# Altium schematic sheet THIEA3000 LIGHTING BOARD V2-1.SchDoc
size B; SheetNumber: 0; SheetTotal: 0
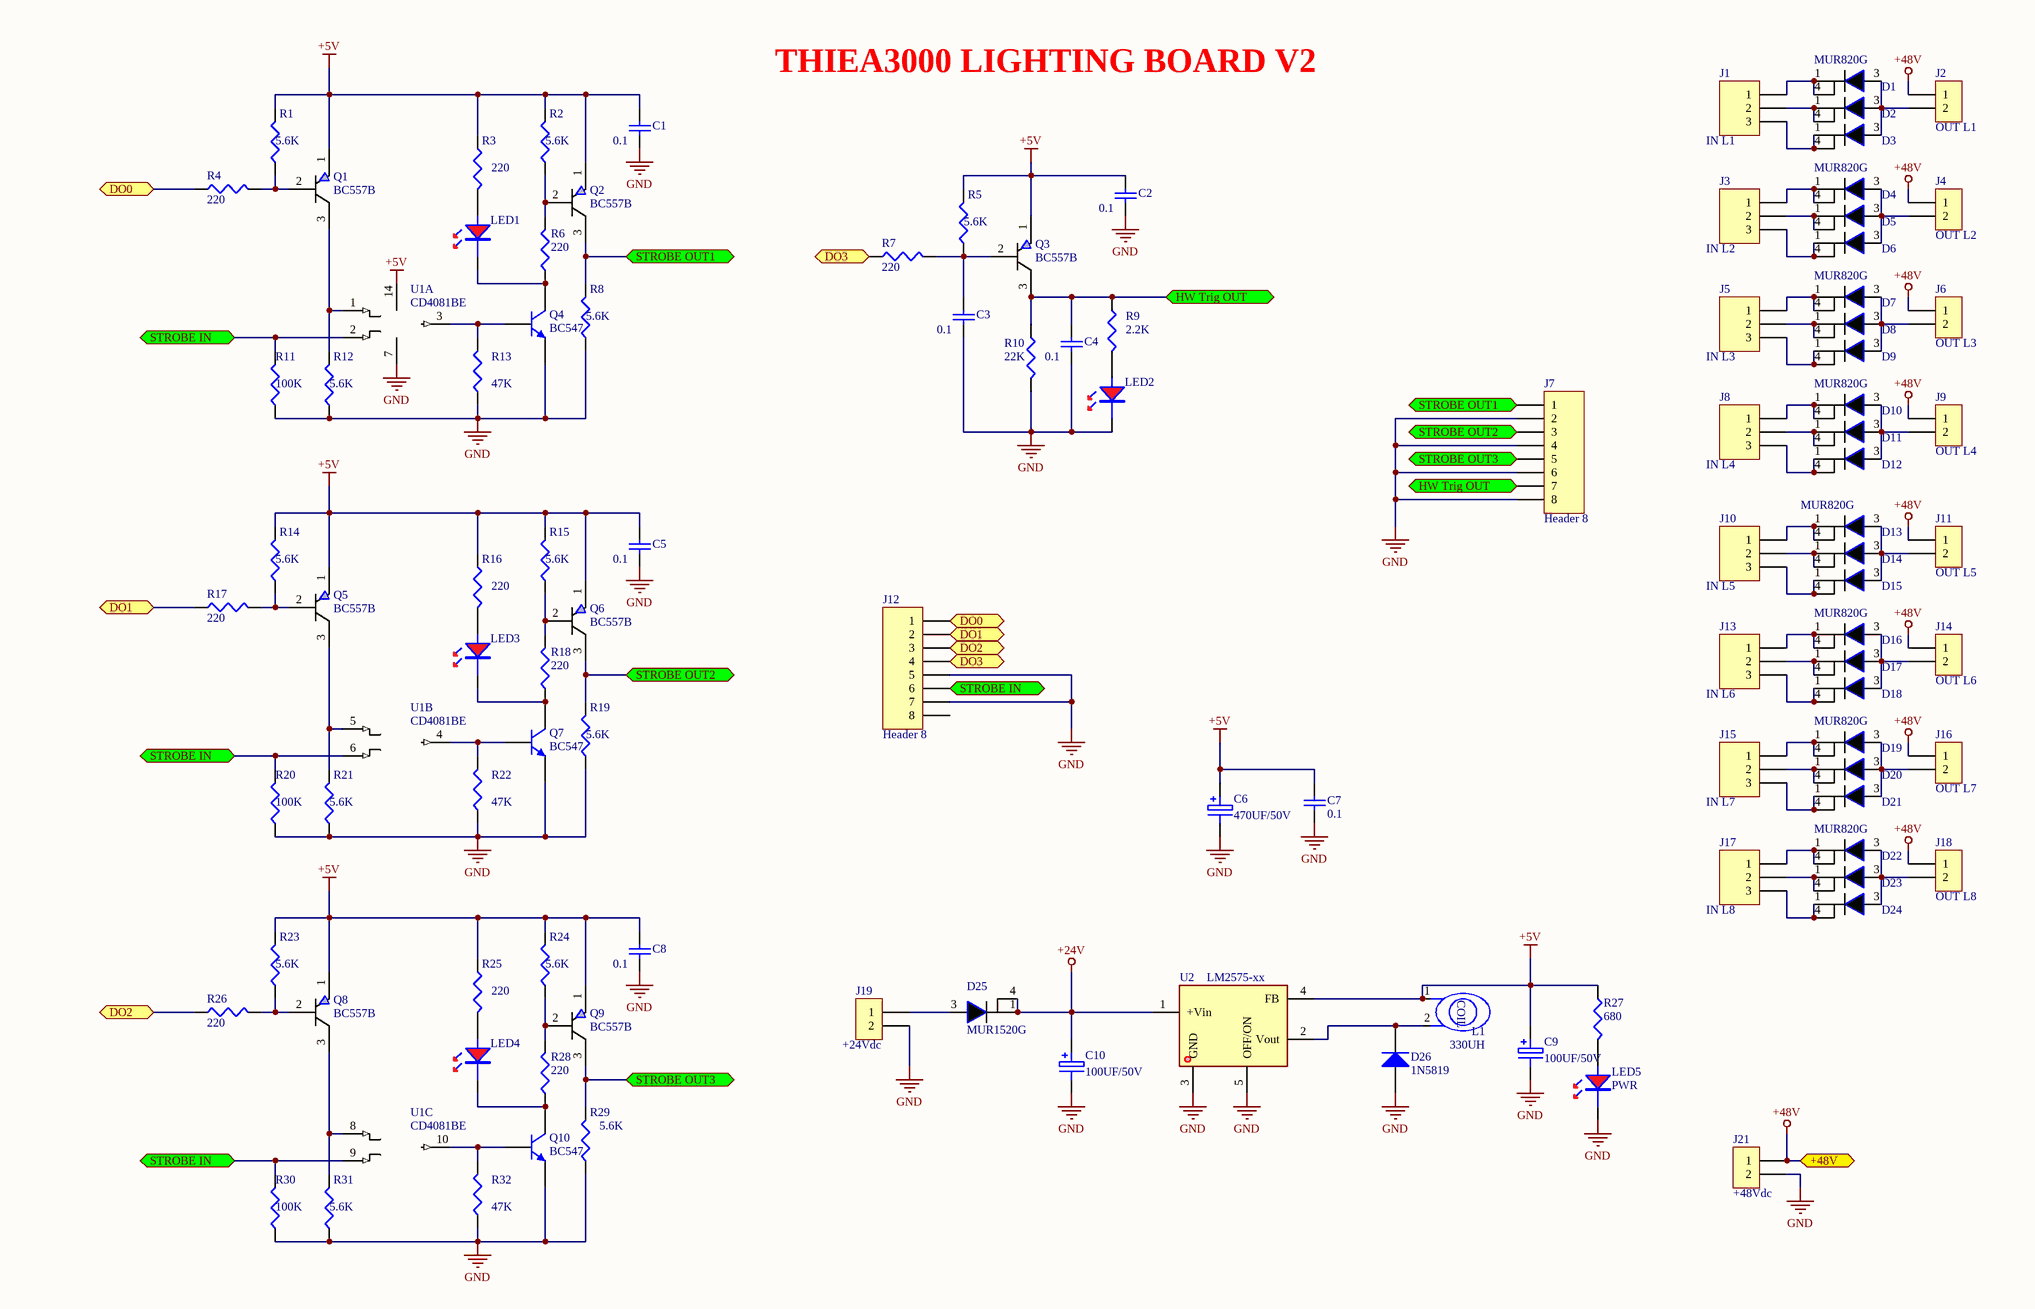
[diagram p0: THIEA3000 LIGHTING BOARD V2-1.SchDoc]

## Parts
C1  value 0.1  [CAP 5/8/Re]  (hidden comment: Cap)
C2  value 0.1  [CAP 5/8/Re]  (hidden comment: Cap)
C3  value 0.1  [CAP 5/8/Re]  (hidden comment: Cap)
C4  value 0.1  [CAP 5/8/Re]  (hidden comment: Cap)
C5  value 0.1  [CAP 5/8/Re]  (hidden comment: Cap)
C6  100UF/50V  [E-CAP 5.0/11]  (value not drawn)
C7  0.1  [CAP 5/8/Re]
C8  value 0.1  [CAP 5/8/Re]  (hidden comment: Cap)
C9  100UF/50V  [E-CAP 3.5/11]
C10  100UF/50V  [E-CAP 3.5/11]
D1  MUR820G  [TO-220(2)]
D2  MUR820G  [TO-220(2)]  (value not drawn)
D3  MUR820G  [TO-220(2)]  (value not drawn)
D4  MUR820G  [TO-220(2)]  (value not drawn)
D5  MUR820G  [TO-220(2)]
D6  MUR820G  [TO-220(2)]  (value not drawn)
D7  MUR820G  [TO-220(2)]
D8  MUR820G  [TO-220(2)]  (value not drawn)
D9  MUR820G  [TO-220(2)]  (value not drawn)
D10  MUR820G  [TO-220(2)]  (value not drawn)
D11  MUR820G  [TO-220(2)]
D12  MUR820G  [TO-220(2)]  (value not drawn)
D13  MUR820G  [TO-220(2)]  (value not drawn)
D14  MUR820G  [TO-220(2)]
D15  MUR820G  [TO-220(2)]  (value not drawn)
D16  MUR820G  [TO-220(2)]
D17  MUR820G  [TO-220(2)]  (value not drawn)
D18  MUR820G  [TO-220(2)]  (value not drawn)
D19  MUR820G  [TO-220(2)]  (value not drawn)
D20  MUR820G  [TO-220(2)]
D21  MUR820G  [TO-220(2)]  (value not drawn)
D22  MUR820G  [TO-220(2)]  (value not drawn)
D23  MUR820G  [TO-220(2)]
D24  MUR820G  [TO-220(2)]  (value not drawn)
D25  MUR1520G  [TO-220-2]
D26  1N5819  [DIODE 10.0]
J1  IN L1  [Plug-in TERM 5.0/3P/R]
J2  OUT L1  [Plug-in TERM 5.0/2P/RH]
J3  IN L2  [Plug-in TERM 5.0/3P/R]
J4  OUT L2  [Plug-in TERM 5.0/2P/RH]
J5  IN L3  [Plug-in TERM 5.0/3P/R]
J6  OUT L3  [Plug-in TERM 5.0/2P/RH]
J7  Header 8  [Plug-in terminal block 8P/3.5/RA]
J8  IN L4  [Plug-in TERM 5.0/3P/R]
J9  OUT L4  [Plug-in TERM 5.0/2P/RH]
J10  IN L5  [Plug-in TERM 5.0/3P/R]
J11  OUT L5  [Plug-in TERM 5.0/2P/RH]
J12  Header 8  [Plug-in terminal block 8P/3.5/RA]
J13  IN L6  [Plug-in TERM 5.0/3P/R]
J14  OUT L6  [Plug-in TERM 5.0/2P/RH]
J15  IN L7  [Plug-in TERM 5.0/3P/R]
J16  OUT L7  [Plug-in TERM 5.0/2P/RH]
J17  IN L8  [Plug-in TERM 5.0/3P/R]
J18  OUT L8  [Plug-in TERM 5.0/2P/RH]
J19  +24Vdc  [Plug-in TERM 5.0/2P/RH]
J21  +48Vdc  [Plug-in TERM 5.0/2P/RH]
L1  L1  [POWER L 4.5mm]  (value not drawn)
LED1  (no value)  [LED 3/2.54/R]
LED2  (no value)  [LED 3/2.54/R]
LED3  (no value)  [LED 3/2.54/R]
LED4  (no value)  [LED 3/2.54/R]
LED5  PWR  [LED 5/2.54/R]
Q1  PNP  [TO-92]  (value not drawn)
Q2  PNP  [TO-92]  (value not drawn)
Q3  PNP  [TO-92]  (value not drawn)
Q4  BC547  [TO-92]
Q5  PNP  [TO-92]  (value not drawn)
Q6  PNP  [TO-92]  (value not drawn)
Q7  BC547  [TO-92]
Q8  PNP  [TO-92]  (value not drawn)
Q9  PNP  [TO-92]  (value not drawn)
Q10  BC547  [TO-92]
R1  22K  [RES 1/4]  (value not drawn)
R2  22K  [RES 1/4]  (value not drawn)
R3  220  [RES 1/4]
R4  220  [RES 1/4]
R5  22K  [RES 1/4]  (value not drawn)
R6  22K  [RES 1/4]  (value not drawn)
R7  22K  [RES 1/4]  (value not drawn)
R8  22K  [RES 1/4]  (value not drawn)
R9  2.2K  [RES 1/4]
R10  22K  [RES 1/4]
R11  22K  [RES 1/4]  (value not drawn)
R12  22K  [RES 1/4]  (value not drawn)
R13  22K  [RES 1/4]  (value not drawn)
R14  22K  [RES 1/4]  (value not drawn)
R15  22K  [RES 1/4]  (value not drawn)
R16  220  [RES 1/4]
R17  220  [RES 1/4]
R18  22K  [RES 1/4]  (value not drawn)
R19  22K  [RES 1/4]  (value not drawn)
R20  22K  [RES 1/4]  (value not drawn)
R21  22K  [RES 1/4]  (value not drawn)
R22  22K  [RES 1/4]  (value not drawn)
R23  22K  [RES 1/4]  (value not drawn)
R24  22K  [RES 1/4]  (value not drawn)
R25  220  [RES 1/4]
R26  220  [RES 1/4]
R27  22K  [RES 1/4]  (value not drawn)
R28  22K  [RES 1/4]  (value not drawn)
R29  22K  [RES 1/4]  (value not drawn)
R30  22K  [RES 1/4]  (value not drawn)
R31  22K  [RES 1/4]  (value not drawn)
R32  22K  [RES 1/4]  (value not drawn)
U1  CD4081BE  [DIP-14L]  (parts A,B,C of 4)
U2  LM2575-xx  [TO-263(U)]

## Ports
+48V, DO0, DO1, DO2, DO3, HW Trig OUT, STROBE IN, STROBE OUT1, STROBE OUT2, STROBE OUT3

## Nets
+5V: C1.2 C2.2 C5.1 C6.1 C7.2 C8.2 C9.1 L1.1 Q1.1(E) Q2.1(E) Q3.1(E) Q5.1(E) Q6.1(E) Q8.1(E) Q9.1(E) R1.2 R2.2 R3.1 R5.2 R14.2 R15.2 R16.1 R23.2 R24.2 R25.1 R27.1 U1.14(+Vcc) U2.4(FB)
+24V: C10.1 D25.1(K2) D25.4(K1) U2.1(+Vin)
+48V: J2.1 J4.1 J6.1 J9.1 J11.1 J14.1 J16.1 J18.1 J21.1 ; port +48V
GND: C1.1 C2.1 C3.1 C4.1 C5.2 C6.2 C7.1 C8.2 C9.2 C10.2 D26.1(A) J7.2 J7.4 J7.6 J7.8 J12.5 J12.7 J19.2 J21.2 LED2.K LED5.K Q4.3(E) Q7.3(E) Q10.3(E) R8.1 R10.2 R11.1 R12.1 R13.1 R19.1 R20.1 R21.1 R22.1 R29.1 R30.1 R31.1 R32.1 U1.7(GND) U2.3(GND) U2.5(OFF/ON)
DO0: J12.1 R4.1 ; port DO0
DO1: J12.2 R17.1 ; port DO1
DO2: J12.3 R26.1 ; port DO2
DO3: J12.4 R7.1 ; port DO3
HW Trig OUT: C4.2 J7.7 Q3.3(C) R9.1 R10.1 ; port HW Trig OUT
STROBE IN: J12.6 R11.2 R20.2 R30.2 U1.2 U1.6 U1.9 ; port STROBE IN
STROBE OUT1: J7.1 Q2.3(C) R8.2 ; port STROBE OUT1
STROBE OUT2: J7.3 Q6.3(C) R19.2 ; port STROBE OUT2
STROBE OUT3: J7.5 Q9.3(C) R29.2 ; port STROBE OUT3
NetC3_2: C3.2 Q3.2(B) R5.1 R7.2
NetD1_1: D1.1(K2) D1.4(K1) J1.1
NetD1_3: D1.3(A2) D2.3(A2) D3.3(A2) J2.2
NetD2_1: D2.1(K2) D2.4(K1) J1.2
NetD3_1: D3.1(K2) D3.4(K1) J1.3
NetD4_1: D4.1(K2) D4.4(K1) J3.2
NetD4_3: D4.3(A2) D5.3(A2) D6.3(A2) J4.2
NetD5_1: D5.1(K2) D5.4(K1) J3.1
NetD6_1: D6.1(K2) D6.4(K1) J3.3
NetD7_1: D7.1(K2) D7.4(K1) J5.1
NetD7_3: D7.3(A2) D8.3(A2) D9.3(A2) J6.2
NetD8_1: D8.1(K2) D8.4(K1) J5.2
NetD9_1: D9.1(K2) D9.4(K1) J5.3
NetD10_1: D10.1(K2) D10.4(K1) J8.2
NetD10_3: D10.3(A2) D11.3(A2) D12.3(A2) J9.2
NetD11_1: D11.1(K2) D11.4(K1) J8.1
NetD12_1: D12.1(K2) D12.4(K1) J8.3
NetD13_1: D13.1(K2) D13.4(K1) J10.2
NetD13_3: D13.3(A2) D14.3(A2) D15.3(A2) J11.2
NetD14_1: D14.1(K2) D14.4(K1) J10.1
NetD15_1: D15.1(K2) D15.4(K1) J10.3
NetD16_1: D16.1(K2) D16.4(K1) J13.1
NetD16_3: D16.3(A2) D17.3(A2) D18.3(A2) J14.2
NetD17_1: D17.1(K2) D17.4(K1) J13.2
NetD18_1: D18.1(K2) D18.4(K1) J13.3
NetD19_1: D19.1(K2) D19.4(K1) J15.2
NetD19_3: D19.3(A2) D20.3(A2) D21.3(A2) J16.2
NetD20_1: D20.1(K2) D20.4(K1) J15.1
NetD21_1: D21.1(K2) D21.4(K1) J15.3
NetD22_1: D22.1(K2) D22.4(K1) J17.2
NetD22_3: D22.3(A2) D23.3(A2) D24.3(A2) J18.2
NetD23_1: D23.1(K2) D23.4(K1) J17.1
NetD24_1: D24.1(K2) D24.4(K1) J17.3
NetD25_3: D25.3(A2) J19.1
NetD26_2: D26.2(K) L1.2 U2.2(Vout)
NetLED1_A: LED1.A R3.2
NetLED1_K: LED1.K Q4.1(C) R6.1
NetLED2_A: LED2.A R9.2
NetLED3_A: LED3.A R16.2
NetLED3_K: LED3.K Q7.1(C) R18.1
NetLED4_A: LED4.A R25.2
NetLED4_K: LED4.K Q10.1(C) R28.1
NetLED5_A: LED5.A R27.2
NetQ1_2: Q1.2(B) R1.1 R4.2
NetQ1_3: Q1.3(C) R12.2 U1.1
NetQ2_2: Q2.2(B) R2.1 R6.2
NetQ4_2: Q4.2(B) R13.2 U1.3
NetQ5_2: Q5.2(B) R14.1 R17.2
NetQ5_3: Q5.3(C) R21.2 U1.5
NetQ6_2: Q6.2(B) R15.1 R18.2
NetQ7_2: Q7.2(B) R22.2 U1.4
NetQ8_2: Q8.2(B) R23.1 R26.2
NetQ8_3: Q8.3(C) R31.2 U1.8
NetQ9_2: Q9.2(B) R24.1 R28.2
NetQ10_2: Q10.2(B) R32.2 U1.10

Not connected (* = marked no-connect by the designer): J12 8

## Notes on the sheet
- THIEA3000 LIGHTING BOARD V2
- (in symbol COIL) 330UH
- (in symbol ELECTRO1) 470UF/50V
- (in symbol PNP) BC557B
- (in symbol RES1) 47K; 5.6K; 220; 680; 100K

## Library data of the parts
C1-C5 C7 C8 = Cap: 0198-0033-8; Published: 8-Jun-2000; LatestRevisionDate: 17-Jul-2002; LatestRevisionNote: Re-released for DXP Platform.; PackageReference: RAD-0.3; Publisher: Altium Limited
  C7: Value: 0.1
C6 C9 C10 = ELECTRO1: 0566-0322-1
D1-D24 = MUR DIODE: 0235-0229-2; pin to pad: 4>1
D25 = MUR DIODE: 0235-0204-9
D26 = Diode 1N914: Published: 8-Jun-2000; LatestRevisionDate: 17-Jul-2002; LatestRevisionNote: Re-released for DXP Platform.; DatasheetVersion: 1997; PackageReference: DO-35; Publisher: Altium Limited; Code_JEDEC: DO-204-AH; ComponentLink1Description: Manufacturer Link; ComponentLink1URL: http://www.fairchildsemi.com/; ComponentLink2Description: Datasheet; ComponentLink2URL: http://www.fairchildsemi.com/ds/1N%2F1N4448.pdf
J1 J3 J5 J8 J10 J13 J15 J17 = Header 3: 0005-0011-2; LatestRevisionDate: 17-Jul-2002; LatestRevisionNote: Re-released for DXP Platform.; Publisher: Altium Limited
J2 J4 J6 J9 J11 J14 J16 J18 J19 J21 = CON2: 0005-0010-9
J7 J12 = Header 8: 0330-0177-5; LatestRevisionDate: 17-Jul-2002; LatestRevisionNote: Re-released for DXP Platform.; Publisher: Altium Limited
L1 = COIL: 0638-0010-8
LED1 LED3 LED4 = LED-R: 0010-0049-1
LED2 = LED-R
LED5 = LED-R: 0302-0042-3
Q1-Q3 Q5 Q6 Q8 Q9 = PNP: 0136-0166-2; pin to pad: 1>3 3>1
Q4 Q7 Q10 = NPN: NPN Bipolar Transistor; Published: 8-Jun-2000; LatestRevisionDate: 17-Jul-2002; LatestRevisionNote: Re-released for DXP Platform.; PackageReference: TO-226; Publisher: Altium Limited; Code_JEDEC: TO-226-AA
R1-R32 = RES1
U1 = CD4081BE: 0086-0196-5